# EasyEDA Pro project ProPrj_HTXStudio_OneHanded_Keyboard.epro, board 键盘-左手（大）
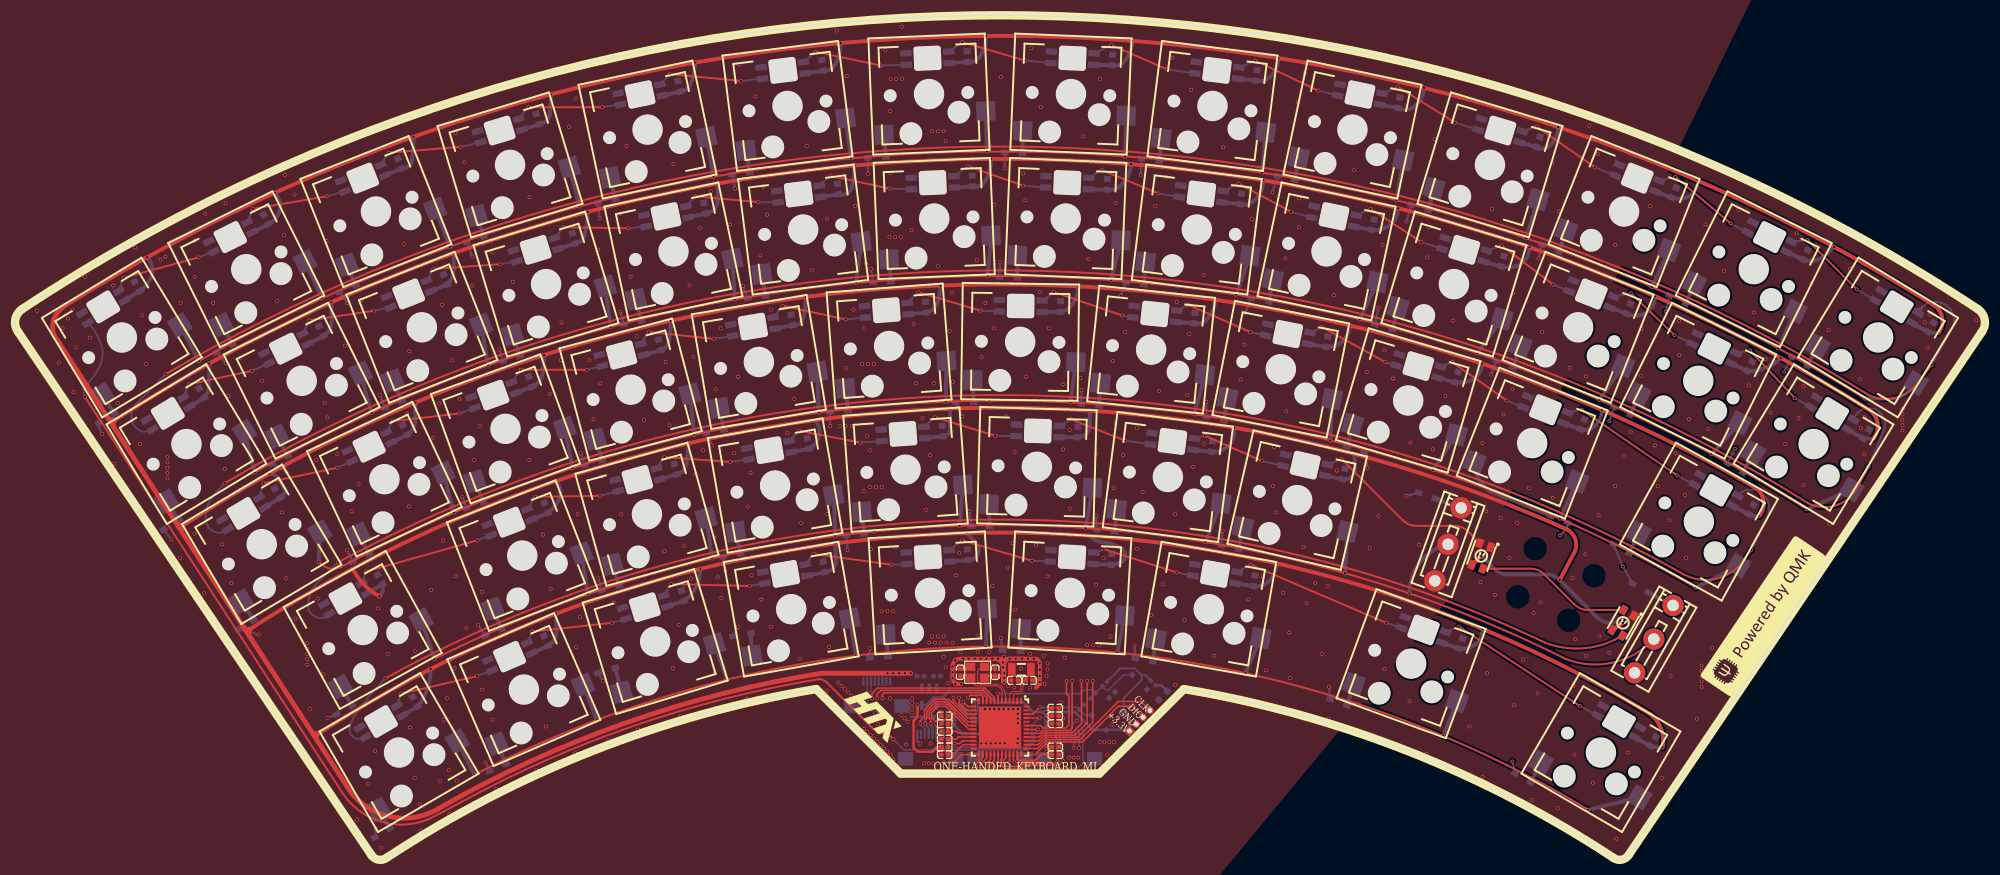
[diagram p16: board, top side]
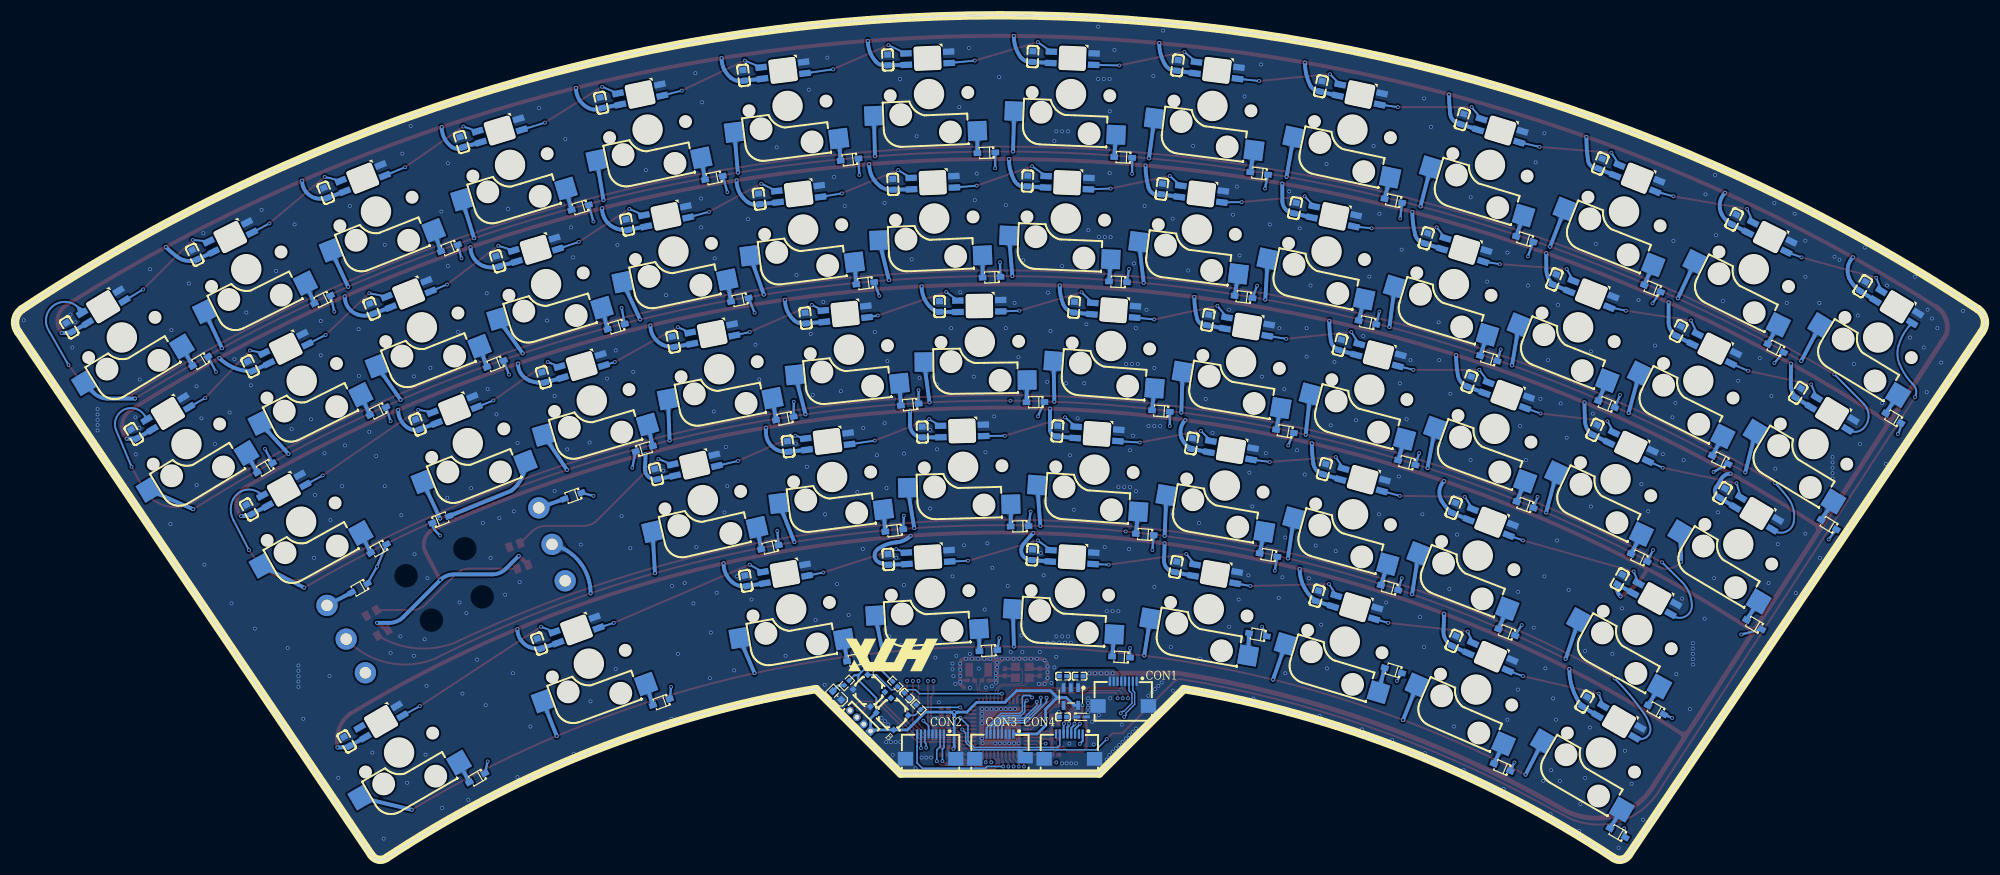
[diagram p17: board, bottom side, seen from below]

Outline 257.76 x 110.64 mm; copper layers: Top Layer, Inner1, Inner2, Bottom Layer. Coordinates in mm from the lower left corner of the outline.
Outline path: 0.4,69.11 arc(0,70.74) 0.9,72.15 arc(128.89,110.64) 256.87,72.14 arc(257.76,70.73) 257.36,69.11 211.15,0.6 arc(210.21,0) 209.13,0.27 arc(182.2,14.26) 152.95,22.36 141.89,11.29 115.89,11.29 104.82,22.36 arc(75.57,14.26) 48.63,0.27 arc(47.55,0) 46.61,0.6 0.4,69.11
Stack: Top Layer 0.035mm 外层铜厚1oz / Dielectric1 0.2104mm 7628 RC49% 8.6mil / Inner1 0.0152mm 内层铜厚 / Dielectric2 1.065mm 1.1mm H/HOZ Copper / Inner2 0.0152mm 内层铜厚 / Dielectric3 0.2104mm 7628 RC49% 8.6mil / Bottom Layer 0.035mm 外层铜厚1oz

## Design rules (mm)
template: 自定义配置
spacing copperThickness1oz (default): track to track 0.102, other pairs 0.152 to 0.3
spacing copperThickness2oz: track to track 0.203, other pairs 0.152 to 0.3
track width copperThickness1oz (default): min 0.127, default 0.254, max 2.54
track width copperThickness2oz: min 0.203, default 0.254, max 2.54
differential pair differentialPair (default): width min 0.127, default 0.254, max 2.54; gap min 0.152, default 0.152
via viaSize (default): diameter min 0.4, default 0.4, max 10; hole min 0.3, default 0.305, max 6.3

## Placement (name value [footprint] x y rotation side)
C1  100nF  [C0603]  15.97 75.13 301.2 bottom
C2  100nF  [C0603]  32.81 83.89 296.4 bottom
C3  100nF  [C0603]  50.32 91.21 291.6 bottom
C4  100nF  [C0603]  68.38 97.04 286.8 bottom
C5  100nF  [C0603]  86.87 101.34 282 bottom
C6  100nF  [C0603]  105.65 104.07 277.2 bottom
C7  100nF  [C0603]  124.6 105.22 272.4 bottom
C8  100nF  [C0603]  143.57 104.79 267.6 bottom
C9  100nF  [C0603]  162.44 102.77 262.8 bottom
C10  100nF  [C0603]  181.08 99.17 258 bottom
C11  100nF  [C0603]  199.35 94.03 253.2 bottom
C12  100nF  [C0603]  217.13 87.38 248.4 bottom
C13  100nF  [C0603]  234.29 79.26 243.6 bottom
C14  100nF  [C0603]  250.71 69.75 238.8 bottom
C15  100nF  [C0603]  24.42 61.17 301.2 bottom
C16  100nF  [C0603]  40.06 69.27 296.4 bottom
C17  100nF  [C0603]  56.33 76.04 291.6 bottom
C18  100nF  [C0603]  73.1 81.42 286.8 bottom
C19  100nF  [C0603]  90.26 85.37 282 bottom
C20  100nF  [C0603]  107.7 87.88 277.2 bottom
C21  100nF  [C0603]  125.28 88.92 272.4 bottom
C22  100nF  [C0603]  142.89 88.48 267.6 bottom
C23  100nF  [C0603]  160.4 86.58 262.8 bottom
C24  100nF  [C0603]  177.69 83.21 258 bottom
C25  100nF  [C0603]  194.63 78.41 253.2 bottom
C26  100nF  [C0603]  211.12 72.2 248.4 bottom
C27  100nF  [C0603]  227.03 64.64 243.6 bottom
C28  100nF  [C0603]  242.25 55.78 238.8 bottom
C29  100nF  [C0603]  34.33 48.04 300.7 bottom
C30  100nF  [C0603]  51.02 56.33 295.2 bottom
C31  100nF  [C0603]  67.45 62.65 290 bottom
C32  100nF  [C0603]  84.38 67.46 284.8 bottom
C33  100nF  [C0603]  101.67 70.72 279.6 bottom
C34  100nF  [C0603]  119.19 72.39 274.4 bottom
C35  100nF  [C0603]  136.8 72.47 269.2 bottom
C36  100nF  [C0603]  154.33 70.96 264 bottom
C37  100nF  [C0603]  171.66 67.86 258.8 bottom
C38  100nF  [C0603]  188.63 63.21 253.6 bottom
C39  100nF  [C0603]  205.11 57.03 248.4 bottom
C40  100nF  [C0603]  227.18 45.89 241.1 bottom
C41  100nF  [C0603]  47.77 36.73 298.8 bottom
C42  100nF  [C0603]  69.51 46.11 291.2 bottom
C43  100nF  [C0603]  86.43 51.18 285.5 bottom
C44  100nF  [C0603]  103.78 54.54 279.8 bottom
C45  100nF  [C0603]  121.38 56.16 274.1 bottom
C46  100nF  [C0603]  139.05 56.03 268.4 bottom
C47  100nF  [C0603]  156.61 54.15 262.7 bottom
C48  100nF  [C0603]  173.91 50.52 257 bottom
C49  100nF  [C0603]  52.37 20.72 300.1 bottom
C50  100nF  [C0603]  69.47 28.68 293.4 bottom
C51  100nF  [C0603]  87.38 34.58 286.8 bottom
C52  100nF  [C0603]  105.86 38.36 280.1 bottom
C53  100nF  [C0603]  124.65 39.96 273.4 bottom
C54  100nF  [C0603]  143.5 39.35 266.6 bottom
C55  100nF  [C0603]  162.15 36.54 259.9 bottom
C56  100nF  [C0603]  189.2 28.31 249.9 bottom
C57  100nF  [C0603]  214.39 15.49 239.8 bottom
C58  100nF  [C0402]  121.64 18.85 180 top
C59  100nF  [C0402]  121.64 16.81 180 top
C60  100nF  [C0402]  141.07 21.51 225 bottom
C61  100nF  [C0402]  121.64 13.77 0 top
C62  100nF  [C0402]  121.64 15.8 0 top
C63  100nF  [C0402]  136.12 17.83 180 top
C64  100nF  [C0402]  136.12 14.78 180 top
C65  100nF  [C0402]  136.12 19.86 180 top
C66  1uF  [C0402]  136.12 18.85 180 top
C67  1uF  [C0402]  136.12 13.77 180 top
C68  100nF  [C0402]  120.63 24.05 0 bottom
C69  1uF  [C0402]  118.47 24.05 180 bottom
C70  1uF  [C0402]  120.63 18.72 180 bottom
C71  20pF  [C0402]  123.67 24.56 90 top
C72  6pF  [C0402]  132.69 23.49 0 top
C73  20pF  [C0402]  128.25 24.56 90 top
C74  6pF  [C0402]  130.79 23.49 180 top
D1  1N4148WS  [SOD-323_L1.8-W1.3-LS2.5-RD]  11.96 57.86 31.2 bottom
D2  1N4148WS  [SOD-323_L1.8-W1.3-LS2.5-RD]  27.36 67.01 26.4 bottom
D3  1N4148WS  [SOD-323_L1.8-W1.3-LS2.5-RD]  43.48 74.85 21.6 bottom
D4  1N4148WS  [SOD-323_L1.8-W1.3-LS2.5-RD]  60.2 81.3 16.8 bottom
D5  1N4148WS  [SOD-323_L1.8-W1.3-LS2.5-RD]  77.4 86.34 12 bottom
D6  1N4148WS  [SOD-323_L1.8-W1.3-LS2.5-RD]  94.96 89.92 7.2 bottom
D7  1N4148WS  [SOD-323_L1.8-W1.3-LS2.5-RD]  112.76 92.02 2.4 bottom
D8  1N4148WS  [SOD-323_L1.8-W1.3-LS2.5-RD]  130.67 92.62 357.6 bottom
D9  1N4148WS  [SOD-323_L1.8-W1.3-LS2.5-RD]  148.57 91.72 352.8 bottom
D10  1N4148WS  [SOD-323_L1.8-W1.3-LS2.5-RD]  166.33 89.32 348 bottom
D11  1N4148WS  [SOD-323_L1.8-W1.3-LS2.5-RD]  183.83 85.45 343.2 bottom
D12  1N4148WS  [SOD-323_L1.8-W1.3-LS2.5-RD]  200.94 80.13 338.4 bottom
D13  1N4148WS  [SOD-323_L1.8-W1.3-LS2.5-RD]  217.55 73.39 333.6 bottom
D14  1N4148WS  [SOD-323_L1.8-W1.3-LS2.5-RD]  233.54 65.3 328.8 bottom
D15  1N4148WS  [SOD-323_L1.8-W1.3-LS2.5-RD]  20.41 43.9 31.2 bottom
D16  1N4148WS  [SOD-323_L1.8-W1.3-LS2.5-RD]  34.62 52.4 26.4 bottom
D17  1N4148WS  [SOD-323_L1.8-W1.3-LS2.5-RD]  49.49 59.67 21.6 bottom
D18  1N4148WS  [SOD-323_L1.8-W1.3-LS2.5-RD]  64.92 65.68 16.8 bottom
D19  1N4148WS  [SOD-323_L1.8-W1.3-LS2.5-RD]  80.79 70.38 12 bottom
D20  1N4148WS  [SOD-323_L1.8-W1.3-LS2.5-RD]  97.01 73.73 7.2 bottom
D21  1N4148WS  [SOD-323_L1.8-W1.3-LS2.5-RD]  113.44 75.71 2.4 bottom
D22  1N4148WS  [SOD-323_L1.8-W1.3-LS2.5-RD]  129.99 76.31 357.6 bottom
D23  1N4148WS  [SOD-323_L1.8-W1.3-LS2.5-RD]  146.53 75.53 352.8 bottom
D24  1N4148WS  [SOD-323_L1.8-W1.3-LS2.5-RD]  162.94 73.36 348 bottom
D25  1N4148WS  [SOD-323_L1.8-W1.3-LS2.5-RD]  179.11 69.83 343.2 bottom
D26  1N4148WS  [SOD-323_L1.8-W1.3-LS2.5-RD]  194.94 64.95 338.4 bottom
D27  1N4148WS  [SOD-323_L1.8-W1.3-LS2.5-RD]  210.29 58.77 333.6 bottom
D28  1N4148WS  [SOD-323_L1.8-W1.3-LS2.5-RD]  225.08 51.33 328.8 bottom
D29  1N4148WS  [SOD-323_L1.8-W1.3-LS2.5-RD]  30.17 30.8 30.7 bottom
D30  1N4148WS  [SOD-323_L1.8-W1.3-LS2.5-RD]  45.23 39.56 25.2 bottom
D31  1N4148WS  [SOD-323_L1.8-W1.3-LS2.5-RD]  60.16 46.48 20 bottom
D32  1N4148WS  [SOD-323_L1.8-W1.3-LS2.5-RD]  75.65 52.02 14.8 bottom
D33  1N4148WS  [SOD-323_L1.8-W1.3-LS2.5-RD]  91.59 56.13 9.6 bottom
D34  1N4148WS  [SOD-323_L1.8-W1.3-LS2.5-RD]  107.83 58.78 4.4 bottom
D35  1N4148WS  [SOD-323_L1.8-W1.3-LS2.5-RD]  124.24 59.95 359.2 bottom
D36  1N4148WS  [SOD-323_L1.8-W1.3-LS2.5-RD]  140.69 59.62 354 bottom
D37  1N4148WS  [SOD-323_L1.8-W1.3-LS2.5-RD]  157.05 57.81 348.8 bottom
D38  1N4148WS  [SOD-323_L1.8-W1.3-LS2.5-RD]  175.43 53.83 163.6 bottom
D39  1N4148WS  [SOD-323_L1.8-W1.3-LS2.5-RD]  202.09 44.57 158.4 bottom
D40  1N4148WS  [SOD-323_L1.8-W1.3-LS2.5-RD]  210.2 40.75 331.1 bottom
D41  1N4148WS  [SOD-323_L1.8-W1.3-LS2.5-RD]  43.05 19.63 28.8 bottom
D42  1N4148WS  [SOD-323_L1.8-W1.3-LS2.5-RD]  62.56 29.79 21.2 bottom
D43  1N4148WS  [SOD-323_L1.8-W1.3-LS2.5-RD]  77.9 35.63 15.5 bottom
D44  1N4148WS  [SOD-323_L1.8-W1.3-LS2.5-RD]  93.75 39.92 9.8 bottom
D45  1N4148WS  [SOD-323_L1.8-W1.3-LS2.5-RD]  109.94 42.61 4.1 bottom
D46  1N4148WS  [SOD-323_L1.8-W1.3-LS2.5-RD]  126.32 43.68 358.4 bottom
D47  1N4148WS  [SOD-323_L1.8-W1.3-LS2.5-RD]  142.72 43.12 352.7 bottom
D48  1N4148WS  [SOD-323_L1.8-W1.3-LS2.5-RD]  158.99 40.93 347 bottom
D49  1N4148WS  [SOD-323_L1.8-W1.3-LS2.5-RD]  184.76 47.67 340.2 bottom
D50  1N4148WS  [SOD-323_L1.8-W1.3-LS2.5-RD]  212.7 35.61 330.3 bottom
D51  1N4148WS  [SOD-323_L1.8-W1.3-LS2.5-RD]  48.05 3.52 30.1 bottom
D52  1N4148WS  [SOD-323_L1.8-W1.3-LS2.5-RD]  63.17 12.1 23.4 bottom
D53  1N4148WS  [SOD-323_L1.8-W1.3-LS2.5-RD]  77.4 24.82 16.8 bottom
D54  1N4148WS  [SOD-323_L1.8-W1.3-LS2.5-RD]  95.12 29.49 10.1 bottom
D55  1N4148WS  [SOD-323_L1.8-W1.3-LS2.5-RD]  113.04 26.55 3.4 bottom
D56  1N4148WS  [SOD-323_L1.8-W1.3-LS2.5-RD]  130.41 27.39 356.6 bottom
D57  1N4148WS  [SOD-323_L1.8-W1.3-LS2.5-RD]  147.75 26.2 349.9 bottom
D58  1N4148WS  [SOD-323_L1.8-W1.3-LS2.5-RD]  173.21 20.64 339.9 bottom
D59  1N4148WS  [SOD-323_L1.8-W1.3-LS2.5-RD]  197.31 10.73 329.9 bottom
D60  ESD5Z3V3  [SOD-523_L1.2-W0.8-LS1.6-RD]  118.21 18.72 180 bottom
FPC1  FPC-05FB-8PH20  [FPC-SMD_8P-P0.50_XUNPU_FPC-05FB-8PH20#2]  112.75 21.77 180 bottom
FPC2  FPC-05FB-8PH20  [FPC-SMD_8P-P0.50_XUNPU_FPC-05FB-8PH20#2]  137.97 14.85 180 bottom
FPC3  FPC-05FB-8PH20  [FPC-SMD_8P-P0.50_XUNPU_FPC-05FB-8PH20]  128.89 14.85 180 bottom
FPC4  FPC-05FB-8PH20  [FPC-SMD_8P-P0.50_XUNPU_FPC-05FB-8PH20#2]  119.8 14.85 180 bottom
H1  PZ127V-11-04-0720  [HDR-TH_4P-P1.27-V-M]  147.17 18.21 45 bottom
LDO1  ME6211C33M5G-N  [SOT-23-5_L3.0-W1.7-P0.95-LS2.8-BL]  119.61 21.39 0 bottom
LED1  NCD0603G1  [LED0603-RD_1]  150.22 21.51 45 bottom
R1  0Ω  [R0402]  121.64 17.83 0 top
R2  10kΩ  [R0402]  142.6 23.04 45 bottom
R3  0Ω  [R0402]  121.64 14.78 0 top
R4  10kΩ  [R0402]  139.55 19.99 225 bottom
R5  1kΩ  [R0402]  148.95 23.16 315 bottom
SW1  K9-1267T  [SW-TH_K9-1267T]  187.52 41.32 70.2 top
SW2  K9-1267T  [SW-TH_K9-1267T]  214.46 28.91 60.3 top
SW3  TS3735A 250gf 030  [SW-SMD_4P-L3.7-W3.7-P2.70-LS3.7]  146.03 22.15 45 bottom
SW4  TS3735A 250gf 030  [SW-SMD_4P-L3.7-W3.7-P2.70-LS3.7]  142.98 19.1 45 bottom
U1  Yo-WS2812B-3528反贴雾状  [LED-SMD_L3.2-W2.8_YO-WS2812B-3528]  11.51 72.44 31.2 bottom
U2  Yo-WS2812B-3528反贴雾状  [LED-SMD_L3.2-W2.8_YO-WS2812B-3528]  28.14 81.58 26.4 bottom
U3  Yo-WS2812B-3528反贴雾状  [LED-SMD_L3.2-W2.8_YO-WS2812B-3528]  45.48 89.29 21.6 bottom
U4  Yo-WS2812B-3528反贴雾状  [LED-SMD_L3.2-W2.8_YO-WS2812B-3528]  63.4 95.54 16.8 bottom
U5  Yo-WS2812B-3528反贴雾状  [LED-SMD_L3.2-W2.8_YO-WS2812B-3528#2]  81.78 100.25 12 bottom
U6  Yo-WS2812B-3528反贴雾状  [LED-SMD_L3.2-W2.8_YO-WS2812B-3528]  100.48 103.42 7.2 bottom
U7  Yo-WS2812B-3528反贴雾状  [LED-SMD_L3.2-W2.8_YO-WS2812B-3528]  119.39 105.01 2.4 bottom
U8  Yo-WS2812B-3528反贴雾状  [LED-SMD_L3.2-W2.8_YO-WS2812B-3528]  138.37 105.01 357.6 bottom
U9  Yo-WS2812B-3528反贴雾状  [LED-SMD_L3.2-W2.8_YO-WS2812B-3528]  157.28 103.42 352.8 bottom
U10  Yo-WS2812B-3528反贴雾状  [LED-SMD_L3.2-W2.8_YO-WS2812B-3528#3]  175.99 100.25 348 bottom
U11  Yo-WS2812B-3528反贴雾状  [LED-SMD_L3.2-W2.8_YO-WS2812B-3528]  194.37 95.54 343.2 bottom
U12  Yo-WS2812B-3528反贴雾状  [LED-SMD_L3.2-W2.8_YO-WS2812B-3528]  212.29 89.29 338.4 bottom
U13  Yo-WS2812B-3528反贴雾状  [LED-SMD_L3.2-W2.8_YO-WS2812B-3528]  229.62 81.58 333.6 bottom
U14  Yo-WS2812B-3528反贴雾状  [LED-SMD_L3.2-W2.8_YO-WS2812B-3528]  246.25 72.45 328.8 bottom
U15  CPG151101S11-16  [SMD_KEYBOARD-SW]  16.44 65.47 211.2 bottom
U16  CPG151101S11-16  [SMD_KEYBOARD-SW]  32.47 74.23 206.4 bottom
U17  CPG151101S11-16  [SMD_KEYBOARD-SW]  49.18 81.61 201.6 bottom
U18  CPG151101S11-16  [SMD_KEYBOARD-SW]  66.44 87.57 196.8 bottom
U19  CPG151101S11-16  [SMD_KEYBOARD-SW]  84.14 92.06 192 bottom
U20  CPG151101S11-16  [SMD_KEYBOARD-SW]  102.16 95.05 187.2 bottom
U21  CPG151101S11-16  [SMD_KEYBOARD-SW]  120.36 96.53 182.4 bottom
U22  CPG151101S11-16  [SMD_KEYBOARD-SW]  138.62 96.48 177.6 bottom
U23  CPG151101S11-16  [SMD_KEYBOARD-SW]  156.82 94.9 172.8 bottom
U24  CPG151101S11-16  [SMD_KEYBOARD-SW]  174.82 91.8 168 bottom
U25  CPG151101S11-16  [SMD_KEYBOARD-SW]  192.49 87.21 163.2 bottom
U26  CPG151101S11-16  [SMD_KEYBOARD-SW]  209.72 81.16 158.4 bottom
U27  CPG151101S11-16  [SMD_KEYBOARD-SW]  226.38 73.68 153.6 bottom
U28  CPG151101S11-16  [SMD_KEYBOARD-SW]  242.37 64.85 148.8 bottom
U29  Yo-WS2812B-3528反贴雾状  [LED-SMD_L3.2-W2.8_YO-WS2812B-3528]  19.97 58.48 31.2 bottom
U30  Yo-WS2812B-3528反贴雾状  [LED-SMD_L3.2-W2.8_YO-WS2812B-3528]  35.4 66.96 26.4 bottom
U31  Yo-WS2812B-3528反贴雾状  [LED-SMD_L3.2-W2.8_YO-WS2812B-3528]  51.48 74.12 21.6 bottom
U32  Yo-WS2812B-3528反贴雾状  [LED-SMD_L3.2-W2.8_YO-WS2812B-3528]  68.11 79.91 16.8 bottom
U33  Yo-WS2812B-3528反贴雾状  [LED-SMD_L3.2-W2.8_YO-WS2812B-3528#2]  85.17 84.29 12 bottom
U34  Yo-WS2812B-3528反贴雾状  [LED-SMD_L3.2-W2.8_YO-WS2812B-3528]  102.53 87.23 7.2 bottom
U35  Yo-WS2812B-3528反贴雾状  [LED-SMD_L3.2-W2.8_YO-WS2812B-3528]  120.08 88.7 2.4 bottom
U36  Yo-WS2812B-3528反贴雾状  [LED-SMD_L3.2-W2.8_YO-WS2812B-3528]  137.69 88.7 357.6 bottom
U37  Yo-WS2812B-3528反贴雾状  [LED-SMD_L3.2-W2.8_YO-WS2812B-3528]  155.23 87.23 352.8 bottom
U38  Yo-WS2812B-3528反贴雾状  [LED-SMD_L3.2-W2.8_YO-WS2812B-3528#3]  172.59 84.29 348 bottom
U39  Yo-WS2812B-3528反贴雾状  [LED-SMD_L3.2-W2.8_YO-WS2812B-3528]  189.65 79.91 343.2 bottom
U40  Yo-WS2812B-3528反贴雾状  [LED-SMD_L3.2-W2.8_YO-WS2812B-3528]  206.28 74.12 338.4 bottom
U41  Yo-WS2812B-3528反贴雾状  [LED-SMD_L3.2-W2.8_YO-WS2812B-3528]  222.37 66.96 333.6 bottom
U42  Yo-WS2812B-3528反贴雾状  [LED-SMD_L3.2-W2.8_YO-WS2812B-3528]  237.8 58.48 328.8 bottom
U43  CPG151101S11-16  [SMD_KEYBOARD-SW]  24.9 51.51 211.2 bottom
U44  CPG151101S11-16  [SMD_KEYBOARD-SW]  39.73 59.61 206.4 bottom
U45  CPG151101S11-16  [SMD_KEYBOARD-SW]  55.18 66.43 201.6 bottom
U46  CPG151101S11-16  [SMD_KEYBOARD-SW]  71.16 71.94 196.8 bottom
U47  CPG151101S11-16  [SMD_KEYBOARD-SW]  87.53 76.1 192 bottom
U48  CPG151101S11-16  [SMD_KEYBOARD-SW]  104.2 78.86 187.2 bottom
U49  CPG151101S11-16  [SMD_KEYBOARD-SW]  121.04 80.23 182.4 bottom
U50  CPG151101S11-16  [SMD_KEYBOARD-SW]  137.94 80.17 177.6 bottom
U51  CPG151101S11-16  [SMD_KEYBOARD-SW]  154.77 78.71 172.8 bottom
U52  CPG151101S11-16  [SMD_KEYBOARD-SW]  171.42 75.84 168 bottom
U53  CPG151101S11-16  [SMD_KEYBOARD-SW]  187.77 71.59 163.2 bottom
U54  CPG151101S11-16  [SMD_KEYBOARD-SW]  203.71 65.99 158.4 bottom
U55  CPG151101S11-16  [SMD_KEYBOARD-SW]  219.13 59.07 153.6 bottom
U56  CPG151101S11-16  [SMD_KEYBOARD-SW]  233.91 50.88 148.8 bottom
U57  Yo-WS2812B-3528反贴雾状  [LED-SMD_L3.2-W2.8_YO-WS2812B-3528]  29.85 45.38 30.7 bottom
U58  Yo-WS2812B-3528反贴雾状  [LED-SMD_L3.2-W2.8_YO-WS2812B-3528]  46.31 54.11 25.2 bottom
U59  Yo-WS2812B-3528反贴雾状  [LED-SMD_L3.2-W2.8_YO-WS2812B-3528]  62.55 60.87 20 bottom
U60  Yo-WS2812B-3528反贴雾状  [LED-SMD_L3.2-W2.8_YO-WS2812B-3528]  79.34 66.13 14.8 bottom
U61  Yo-WS2812B-3528反贴雾状  [LED-SMD_L3.2-W2.8_YO-WS2812B-3528]  96.54 69.85 9.6 bottom
U62  Yo-WS2812B-3528反贴雾状  [LED-SMD_L3.2-W2.8_YO-WS2812B-3528]  114 71.99 4.4 bottom
U63  Yo-WS2812B-3528反贴雾状  [LED-SMD_L3.2-W2.8_YO-WS2812B-3528]  131.59 72.55 359.2 bottom
U64  Yo-WS2812B-3528反贴雾状  [LED-SMD_L3.2-W2.8_YO-WS2812B-3528]  149.15 71.5 354 bottom
U65  Yo-WS2812B-3528反贴雾状  [LED-SMD_L3.2-W2.8_YO-WS2812B-3528]  166.55 68.87 348.8 bottom
U66  Yo-WS2812B-3528反贴雾状  [LED-SMD_L3.2-W2.8_YO-WS2812B-3528]  183.64 64.68 343.6 bottom
U67  Yo-WS2812B-3528反贴雾状  [LED-SMD_L3.2-W2.8_YO-WS2812B-3528]  200.27 58.95 338.4 bottom
U68  Yo-WS2812B-3528反贴雾状  [LED-SMD_L3.2-W2.8_YO-WS2812B-3528]  222.62 48.41 331.1 bottom
U69  CPG151101S11-16  [SMD_KEYBOARD-SW]  34.72 38.37 210.7 bottom
U70  CPG151101S11-16  [SMD_KEYBOARD-SW]  50.49 46.67 205.2 bottom
U71  CPG151101S11-16  [SMD_KEYBOARD-SW]  66.04 53.08 200 bottom
U72  CPG151101S11-16  [SMD_KEYBOARD-SW]  82.11 58.06 194.8 bottom
U73  CPG151101S11-16  [SMD_KEYBOARD-SW]  98.56 61.56 189.6 bottom
U74  CPG151101S11-16  [SMD_KEYBOARD-SW]  115.26 63.56 184.4 bottom
U75  CPG151101S11-16  [SMD_KEYBOARD-SW]  132.08 64.03 179.2 bottom
U76  CPG151101S11-16  [SMD_KEYBOARD-SW]  148.87 62.98 174 bottom
U77  CPG151101S11-16  [SMD_KEYBOARD-SW]  165.49 60.41 168.8 bottom
U78  CPG151101S11-16  [SMD_KEYBOARD-SW]  181.82 56.34 163.6 bottom
U79  CPG151101S11-16  [SMD_KEYBOARD-SW]  197.71 50.81 158.4 bottom
U80  CPG151101S11-16  [SMD_KEYBOARD-SW]  219.04 40.66 151.1 bottom
U81  Yo-WS2812B-3528反贴雾状  [LED-SMD_L3.2-W2.8_YO-WS2812B-3528]  43.21 34.22 28.8 bottom
U82  Yo-WS2812B-3528反贴雾状  [LED-SMD_L3.2-W2.8_YO-WS2812B-3528]  64.65 44.23 21.2 bottom
U83  Yo-WS2812B-3528反贴雾状  [LED-SMD_L3.2-W2.8_YO-WS2812B-3528]  81.42 49.79 15.5 bottom
U84  Yo-WS2812B-3528反贴雾状  [LED-SMD_L3.2-W2.8_YO-WS2812B-3528]  98.65 53.66 9.8 bottom
U85  Yo-WS2812B-3528反贴雾状  [LED-SMD_L3.2-W2.8_YO-WS2812B-3528]  116.18 55.79 4.1 bottom
U86  Yo-WS2812B-3528反贴雾状  [LED-SMD_L3.2-W2.8_YO-WS2812B-3528]  133.84 56.18 358.4 bottom
U87  Yo-WS2812B-3528反贴雾状  [LED-SMD_L3.2-W2.8_YO-WS2812B-3528]  151.45 54.81 352.7 bottom
U88  Yo-WS2812B-3528反贴雾状  [LED-SMD_L3.2-W2.8_YO-WS2812B-3528]  168.83 51.69 347 bottom
U89  XL-3528RGBC-WS2812B  [LED-SMD_4P-L3.5-W2.8-BR-1]  191.87 39.8 70.2 top
U90  XL-3528RGBC-WS2812B  [LED-SMD_4P-L3.5-W2.8-BR-1]  210.42 31.04 60.3 top
U91  CPG151101S11-16  [SMD_KEYBOARD-SW]  47.85 27.06 208.8 bottom
U92  CPG151101S11-16  [SMD_KEYBOARD-SW]  68.3 36.51 201.2 bottom
U93  CPG151101S11-16  [SMD_KEYBOARD-SW]  84.28 41.75 195.5 bottom
U94  CPG151101S11-16  [SMD_KEYBOARD-SW]  100.7 45.37 189.8 bottom
U95  CPG151101S11-16  [SMD_KEYBOARD-SW]  117.4 47.35 184.1 bottom
U96  CPG151101S11-16  [SMD_KEYBOARD-SW]  134.21 47.65 178.4 bottom
U97  CPG151101S11-16  [SMD_KEYBOARD-SW]  150.97 46.29 172.7 bottom
U98  CPG151101S11-16  [SMD_KEYBOARD-SW]  167.52 43.27 167 bottom
U99  Yo-WS2812B-3528反贴雾状  [LED-SMD_L3.2-W2.8_YO-WS2812B-3528]  47.87 18.11 30.1 bottom
U100  Yo-WS2812B-3528反贴雾状  [LED-SMD_L3.2-W2.8_YO-WS2812B-3528]  64.7 26.61 23.4 bottom
U101  Yo-WS2812B-3528反贴雾状  [LED-SMD_L3.2-W2.8_YO-WS2812B-3528]  82.4 33.08 16.8 bottom
U102  Yo-WS2812B-3528反贴雾状  [LED-SMD_L3.2-W2.8_YO-WS2812B-3528]  100.73 37.45 10.1 bottom
U103  Yo-WS2812B-3528反贴雾状  [LED-SMD_L3.2-W2.8_YO-WS2812B-3528]  119.46 39.65 3.4 bottom
U104  Yo-WS2812B-3528反贴雾状  [LED-SMD_L3.2-W2.8_YO-WS2812B-3528]  138.31 39.65 356.6 bottom
U105  Yo-WS2812B-3528反贴雾状  [LED-SMD_L3.2-W2.8_YO-WS2812B-3528]  157.03 37.45 349.9 bottom
U106  Yo-WS2812B-3528反贴雾状  [LED-SMD_L3.2-W2.8_YO-WS2812B-3528]  184.31 30.1 339.9 bottom
U107  Yo-WS2812B-3528反贴雾状  [LED-SMD_L3.2-W2.8_YO-WS2812B-3528]  209.89 18.11 329.9 bottom
U108  CPG151101S11-16  [SMD_KEYBOARD-SW]  52.67 11.06 210.2 bottom
U109  CPG151101S11-16  [SMD_KEYBOARD-SW]  68.64 19.04 203.4 bottom
U110  CPG151101S11-16  [SMD_KEYBOARD-SW]  85.43 25.11 196.8 bottom
U111  CPG151101S11-16  [SMD_KEYBOARD-SW]  102.82 29.18 190.1 bottom
U112  CPG151101S11-16  [SMD_KEYBOARD-SW]  120.56 31.19 183.3 bottom
U113  CPG151101S11-16  [SMD_KEYBOARD-SW]  138.42 31.12 176.7 bottom
U114  CPG151101S11-16  [SMD_KEYBOARD-SW]  156.14 28.97 169.9 bottom
U115  CPG151101S11-16  [SMD_KEYBOARD-SW]  181.96 21.9 159.9 bottom
U116  CPG151101S11-16  [SMD_KEYBOARD-SW]  206.15 10.44 149.8 bottom
U217  STM32G431CBU6  [VQFN-48_L7.0-W7.0-P0.50-BL-EP5.5]  128.89 17.32 180 top
X1  12MHz  [OSC-SMD_4P-L2.5-W2.0-BL]  125.96 24.56 0 top
X2  32.768kHz  [FC-135R_L3.2-W1.5]  131.68 24.9 0 top

## Footprints (pads in the part's own frame, mm; a bottom-side part is the same pattern mirrored in y, then rotated)
C0402
  rect 0.63x0.54 smd: 1(-0.465,0) 2(0.465,0)
C0603
  rect 0.8x0.9 smd: 1(-0.7,0) 2(0.7,0)
FC-135R_L3.2-W1.5
  rect 1x1.8 smd: 1(-1.25,0) 2(1.25,0)
FPC-SMD_8P-P0.50_XUNPU_FPC-05FB-8PH20
  rect 0.3x1.2 smd: 1(1.75,1.625) 2(1.25,1.625) 3(0.75,1.625) 4(0.25,1.625) 5(-0.25,1.625) 6(-0.75,1.625) 7(-1.25,1.625) 8(-1.75,1.625)
  rect 2x1.8 smd: 9(-3.3,-1.625)
  custom 2.003x1.801 smd: 10(3.3,-1.47)
FPC-SMD_8P-P0.50_XUNPU_FPC-05FB-8PH20#2
  rect 0.3x1.2 smd: 1(1.75,1.625) 2(1.25,1.625) 3(0.75,1.625) 4(0.25,1.625) 5(-0.25,1.625) 6(-0.75,1.625) 7(-1.25,1.625) 8(-1.75,1.625)
  rect 2x1.8 smd: 9(-3.3,-1.625) 10(3.3,-1.625)
HDR-TH_4P-P1.27-V-M
  rect 1x1 hole 0.6: 1(-1.905,0)
  round 1 hole 0.6: 2(-0.635,0) 3(0.635,0) 4(1.905,0)
LED0603-RD_1
  rect 0.8x0.8 smd: 1(-0.799,-0.004) 2(0.799,0.004)
LED-SMD_4P-L3.5-W2.8-BR-1
  rect 1.2x0.9 smd: 1(1.5,-0.75) 2(1.5,0.75) 3(-1.5,0.75) 4(-1.5,-0.75)
LED-SMD_L3.2-W2.8_YO-WS2812B-3528
  rect 1.5x0.82 smd: 1(2.8,0.75) 2(2.8,-0.75) 3(-2.8,-0.75) 4(-2.8,0.75)
LED-SMD_L3.2-W2.8_YO-WS2812B-3528#2
  rect 1.5x0.82 smd: 1(2.8,0.75) 2(2.8,-0.75) 3(-2.8,-0.75) 4(-2.8,0.75)
LED-SMD_L3.2-W2.8_YO-WS2812B-3528#3
  rect 1.5x0.82 smd: 1(2.8,0.75) 2(2.8,-0.75) 3(-2.8,-0.75) 4(-2.8,0.75)
OSC-SMD_4P-L2.5-W2.0-BL
  rect 1.2x1.1 smd: 1(-0.899,-0.712) 2(0.899,-0.712) 3(0.899,0.712) 4(-0.899,0.712)
R0402
  rect 0.566x0.54 smd: 1(-0.433,0) 2(0.433,0)
SMD_KEYBOARD-SW
  rect 2.5x2.55 smd: 1(-6.725,1.27) 2(6.725,-1.27)
SOD-323_L1.8-W1.3-LS2.5-RD
  rect 1x0.75 smd: 1(-1.173,0) 2(1.173,0)
SOD-523_L1.2-W0.8-LS1.6-RD
  rect 0.93x0.36 smd: 1(-0.635,0) 2(0.635,0)
SOT-23-5_L3.0-W1.7-P0.95-LS2.8-BL
  rect 0.49x1.157 smd: 1(-0.95,-1.153) 2(0,-1.153) 3(0.95,-1.153)
  rect 0.49x1.175 smd: 4(0.95,1.153) 5(-0.95,1.153)
SW-SMD_4P-L3.7-W3.7-P2.70-LS3.7
  rect 0.65x0.65 smd: 1(-1.6,1.35) 2(1.6,1.35) 3(-1.6,-1.35) 4(1.6,-1.35)
SW-TH_K9-1267T
  round 2.8 hole 1.5: 1(-5.08,0) 2(0,0) 3(5.08,0)
VQFN-48_L7.0-W7.0-P0.50-BL-EP5.5
  oval 0.28x0.85 smd: 1(-2.75,-3.474) 2(-2.25,-3.474) 3(-1.75,-3.474) 4(-1.25,-3.474) 5(-0.75,-3.474) 6(-0.25,-3.474) 7(0.25,-3.474) 8(0.75,-3.474) 9(1.25,-3.474) 10(1.75,-3.474) 11(2.25,-3.474) 12(2.75,-3.474) 25(2.75,3.474) 26(2.25,3.474) 27(1.75,3.474) 28(1.25,3.474) 29(0.75,3.474) 30(0.25,3.474) 31(-0.25,3.474) 32(-0.75,3.474) 33(-1.25,3.474) 34(-1.75,3.474) 35(-2.25,3.474) 36(-2.75,3.474)
  oval 0.85x0.28 smd: 13(3.474,-2.75) 14(3.474,-2.25) 15(3.474,-1.75) 16(3.474,-1.25) 17(3.474,-0.75) 18(3.474,-0.25) 19(3.474,0.25) 20(3.474,0.75) 21(3.474,1.25) 22(3.474,1.75) 23(3.474,2.25) 24(3.474,2.75) 37(-3.474,2.75) 38(-3.474,2.25) 39(-3.474,1.75) 40(-3.474,1.25) 41(-3.474,0.75) 42(-3.474,0.25) 43(-3.474,-0.25) 44(-3.474,-0.75) 45(-3.474,-1.25) 46(-3.474,-1.75) 47(-3.474,-2.25) 48(-3.474,-2.75)
  rect 5.5x5.5 smd: 49(0,0)

## Nets
As in the schematic.

Pads without a net: FPC4 2 8; LDO1 4; SW1 1; SW2 1; SW3 3; SW4 4; U107 2; U217 2 24 44 47

## Via types
v1: diameter 0.5, hole 0.3, Top Layer to Bottom Layer, 900 vias

## Routing (per net, layer and track width the routed paths; a pad name or vN(x,y) marks a point on that pad's centre or on a via; arc(x,y) is an arc through that point)
+3.3V: length 86.2
  Top Layer w0.203: 125.34,15.07 124.09,15.07 122.79,13.77 C61.2 122.11,13.81 121.21,14.71 R3.1 ; R1.1 121.21,17.9 122.11,18.8 C58.1 122.87,18.08 v1(122.91,18.08)
  Top Layer w0.254: v1(134.98,14.53) 135.23,14.78 C64.2 C67.2 134.22,13.77 133.45,13 131.29,13 131.14,13.16 131.14,13.77
  Top Layer w0.305: R3.1 120.63,14.78 119.99,14.15 118.09,14.15 117.58,14.65 117.58,18.21 118.09,18.72 v1(118.09,20.24)
  Bottom Layer w0.254: 147.42,24.18 147.93,24.18 R5.1 ; 147.42,24.18 147.42,23.54 145.06,21.19 145.06,19.28 ; 147.42,24.18 146.53,25.07 144.63,25.07 142.9,23.34
  Bottom Layer w0.355: 134.36,19.34 v1(134.88,19.34) ; 134.36,19.34 133.21,19.34 131.93,20.62 128.25,20.62 126.72,22.15 122.28,22.15 121.39,21.26 ; 134.36,19.34 arc(134.73,19.19) 134.88,18.83 ; v1(134.88,19.34) 134.88,18.83 ; v1(134.88,19.34) 135.4,19.34 ; 121.39,21.26 122.91,19.73 v1(122.91,18.08) 122.91,17.58 124.02,16.47 FPC3.1 ; 121.39,21.26 120.21,21.26 119.19,20.23 LDO1.5 ; 145.06,19.28 145.82,18.52 H1.1 145.67,17.01 SW4.1 141,17.01 138.67,19.34 135.4,19.34 ; 134.88,18.83 v1(134.88,18.49) 134.88,14.63 v1(134.98,14.53) ; 134.88,18.83 arc(135.03,19.19) 135.4,19.34
+5V: length 1696.4
  Top Layer w0.508: 6.33,72.44 arc(128.64,107.94) 251.03,72.69 arc(252.2,71) v1(251.69,69.01) ; 12.51,57.25 arc(127.31,91.81) 242.61,58.95 arc(243.74,57.19) v1(243.18,55.17) ; 12.96,56.58 arc(12.9,57.22) 13.28,57.75 arc(12.66,57.69) 12.09,57.91 ; 21.45,43.47 arc(123.77,75.32) 227.6,48.82 arc(228.81,47.06) v1(228.2,45.01) ; 21.84,42.86 arc(21.83,43.41) 22.1,43.9 ; 22.1,43.89 arc(21.51,43.9) 21,44.17 ; 30.27,29.92 arc(114.9,58.68) 202.95,43.33 arc(204.2,41.92) 203.94,40.05 v1(202.14,36.64) ; 30.6,29.38 arc(30.62,29.9) 30.91,30.34 arc(30.35,30.23) 29.86,30.51 ; 39.17,16.19 arc(126.15,42.84) 213.97,19.1 arc(215.41,17.13) v1(215.58,14.7) ; 39.47,15.7 arc(39.48,16.2) 39.79,16.58 ; 39.79,16.59 arc(39.25,16.55) 38.77,16.78 ; v1(47.67,34.5) arc(45.64,36.04) 44.15,38.11 ; v1(210.42,31.04) U90.3 ; U89.3 v1(191.87,39.8)
  Top Layer w0.635: 6.33,72.44 arc(5.06,70.81) 5.05,68.76 43.28,9.83 arc(48.62,5.74) 55.28,6.64 arc(79.63,17.84) 105.6,24.45 ; v1(117.2,24.43) v1(116.44,24.43) v1(115.67,24.43) v1(114.91,24.43) v1(114.15,24.43) 105.64,24.43
  Bottom Layer w0.508: 211.93,16.05 214.04,14.89 arc(214.81,14.75) v1(215.58,14.7) ; U12.1 C12.2 arc(217.64,86.59) 218.41,86.66 arc(219.72,87.5) v1(220.22,88.96) ; 66.29,95.63 C4.2 arc(69.5,96.8) 69.95,97.71 arc(70.07,98.98) v1(70.11,100.25) ; 22.75,59.28 C15.2 arc(25.23,61.37) 25.37,62.28 arc(25.36,63.63) v1(25.35,64.99) ; U7.1 C7.2 arc(125.52,104.64) 126.21,105.2 arc(126.85,106.5) v1(127.07,107.93) ; U6.1 C6.2 arc(106.63,103.56) 107.29,104.19 arc(107.85,105.54) v1(108.04,106.99) ; v1(140.66,58.84) 140.66,56.97 arc(140.18,55.81) C46.2 U86.1 ; 248.25,70.34 250.34,69.14 arc(251.01,69.04) v1(251.69,69.01) ; v1(122.34,59.1) 122.34,56.38 arc(122.07,55.73) 121.42,55.47 U85.1 ; U9.1 162.35,102.07 arc(163.25,102.04) 164.06,102.41 arc(164.99,103.57) v1(165.33,105.02) ; 196.83,94.01 199.15,93.36 arc(199.9,93.14) 200.63,93.39 arc(201.6,94.53) v1(201.95,95.98) ; U68.1 C40.2 arc(227.5,45.07) v1(228.2,45.01) ; U84.1 C44.2 arc(104.64,54.46) 105.13,55.29 arc(105.22,56.51) v1(104.63,57.59) ; U63.1 C35.2 arc(137.31,71.9) 137.77,72.18 arc(138.78,73.5) v1(139.14,75.12) ; 224.54,65.04 C27.2 arc(229.07,64.42) v1(231.06,65.73) ; 171.39,50.33 C48.2 arc(174.93,50.2) 175.36,51.36 arc(175.29,52.26) v1(175.27,53.16) ; 14.29,73.24 C1.2 arc(17.16,75.29) 17.75,76.25 arc(17.91,77.67) v1(17.25,78.93) ; U61.1 C33.2 arc(102.61,70.22) 103.1,70.91 arc(103.36,72.31) v1(103.45,73.74) ; 103.62,37.2 C52.2 arc(107.04,38.18) 107.42,39.29 arc(107.36,40.37) v1(107.35,41.44) ; U87.1 C47.2 156.98,53.45 arc(158.77,54.19) 159.52,55.99 v1(159.52,56.61) ; U33.1 C19.2 arc(91.48,85.18) 91.92,86.28 v1(91.94,88.59) ; U104.1 C54.2 arc(144.05,38.74) 144.63,38.91 arc(145.29,39.72) 144.88,40.69 arc(143.74,41.3) 142.47,41.58 arc(141.44,41.84) v1(140.58,42.45) ; U34.1 C20.2 arc(108.81,87.26) 109.45,88.06 arc(109.73,89.5) v1(109.83,90.96) ; U105.1 162.03,35.85 arc(163.04,35.9) 163.93,36.37 arc(164.77,37.47) v1(165.07,38.83) ; U59.1 C31.2 arc(68.5,62.54) 68.94,63.42 arc(69.13,64.76) v1(69.19,66.11) ; U5.1 87.01,100.65 arc(87.73,100.85) 88.24,101.39 arc(88.78,102.88) v1(88.97,104.44) ; 67.53,44.54 C42.2 arc(70.5,46.19) 71.09,47.04 arc(71.36,48.38) v1(70.76,49.61) ; U30.1 C16.2 arc(41.11,69.39) 41.38,70.41 v1(41.37,73.03) ; U32.1 C18.2 arc(74.08,81.11) 74.52,81.84 arc(74.81,83.34) v1(74.91,84.87) ; U64.1 C36.2 arc(155.08,70.28) 155.8,70.66 arc(156.71,71.88) v1(157.03,73.36) ; U39.1 C25.2 arc(195.44,77.59) 196.44,77.77 arc(197.7,78.73) v1(198.18,80.24) ; U65.1 C37.2 arc(172.32,67.23) 173.08,67.49 arc(174.22,68.51) v1(174.64,69.99) ; 82.24,66.12 84.55,66.78 arc(85.23,67.25) 85.57,67.99 arc(85.74,69.3) v1(85.79,70.61) ; U38.1 C24.2 arc(178.37,82.52) 179.17,82.73 arc(180.48,83.76) v1(180.97,85.35) ; U42.1 241.89,55.18 arc(242.53,55.17) v1(243.18,55.17) ; 48.35,89.63 C3.2 arc(51.46,90.82) 51.92,91.62 arc(52.08,93.16) v1(52.13,94.71) ; U35.1 C21.2 arc(126.27,88.3) 126.97,88.95 arc(127.52,90.33) v1(127.71,91.81) ; U99.1 C49.2 arc(53.95,22.42) v1(54.37,24.99) ; U106.1 C56.2 arc(189.73,27.66) 190.47,27.86 arc(191.62,28.81) v1(192.05,30.23) ; 67.56,27.03 C50.2 arc(70.59,28.87) 70.84,30.02 arc(70.78,31.13) v1(70.77,32.24) ; U66.1 C38.2 arc(189.47,62.53) 190.47,62.79 arc(191.56,63.66) v1(191.97,65) ; U57.1 34.69,47.43 arc(35.27,48.01) 35.15,48.82 arc(34.82,49.31) 34.52,49.83 arc(33.99,50.38) v1(33.26,50.59) ; U62.1 C34.2 arc(120.08,72.07) 120.62,72.82 arc(120.96,74) v1(121.08,75.23) ; U36.1 C22.2 arc(143.72,87.83) 144.5,88.19 arc(145.61,89.47) v1(146.01,91.13) ; 122.29,39.07 C53.2 arc(125.95,39.91) 125.83,41.32 arc(125.2,42.08) v1(124.52,42.8) ; U31.1 C17.2 arc(57.17,76.31) 57.38,77.39 v1(57.39,79.47) ; v1(210.42,31.04) 208.8,31.04 arc(207.83,31.23) 207,31.78 v1(202.14,36.64) arc(201.32,37.19) 200.34,37.39 195.34,37.39 arc(194.36,37.58) 193.54,38.13 v1(191.87,39.8) ; 157.91,86.13 C23.2 arc(161.14,85.83) 161.9,86.15 arc(162.97,87.41) v1(163.36,89.01) ; U58.1 C30.2 arc(52.01,56.39) 52.3,57.33 arc(52.36,58.62) v1(52.39,59.91) ; 178.57,98.94 C10.2 arc(181.83,98.27) 182.73,98.47 arc(183.93,99.56) v1(184.38,101.12) ; U2.1 C2.2 arc(33.85,83.79) 34.39,84.5 arc(34.66,86.01) v1(33.98,87.38) ; U40.1 C26.2 arc(211.89,71.28) 212.95,71.42 arc(214.18,72.34) v1(214.65,73.8) ; U83.1 86.62,50.5 arc(87.44,51) 87.86,51.86 arc(88.01,53.2) v1(88.07,54.55) ; U8.1 C8.2 arc(144.41,104.11) 145.14,104.57 arc(145.91,105.83) v1(146.18,107.28) ; U81.1 C41.2 arc(48.1,35.25) v1(47.67,34.5) ; U67.1 C39.2 arc(205.62,56.3) 206.35,56.56 arc(207.3,57.58) v1(207.65,58.93) ; U101.1 87.58,33.91 arc(89.11,35.77) v1(89.66,38.11) ; 231.79,79.66 C13.2 arc(235.25,78.46) 236.45,78.92 arc(237.28,79.56) v1(238.06,80.28)
GND: length 37.4
  Top Layer w0.254: 129.26,24.31 arc(129.35,24.37) v1(129.43,24.45)
  Top Layer w0.305: v1(134.09,23.28) 133.88,23.49 C72.2 ; C74.2 129.43,23.49 ; X1.2 127.11,24.1 C73.1 129.26,24.1 ; 122.66,25.01 122.67,25.03 C71.2 124.81,25.03 arc(124.99,25.1) X1.4
  Top Layer w0.508: 132.08,26.33 v1(132.53,26.33) v1(133.33,26.33) 133.45,26.33 arc(133.9,26.14) v1(134.09,25.7) v1(134.09,24.89) v1(134.09,24.09) v1(134.09,23.28) 134.09,23.04 133.58,22.53 ; 132.08,26.33 v1(131.74,26.33) v1(130.95,26.33) v1(130.15,26.33) ; 132.08,26.33 arc(132.08,26.34) 132.07,26.34 v1(128.63,26.34) 128.12,26.34 ; v1(129.26,25.2) 129.26,23.39 arc(129.31,23.27) v1(129.43,23.22) v1(129.43,23.83) v1(129.43,24.45) 129.43,25.61 arc(129.44,25.7) 129.45,25.78 arc(129.71,26.18) v1(130.15,26.33) ; v1(129.26,25.2) 129.26,25.44 ; v1(129.26,25.2) arc(129.23,25.48) 129.12,25.75 arc(128.89,26.04) 128.58,26.24 arc(128.36,26.31) 128.12,26.34 ; 128.12,26.34 v1(127.87,26.34) v1(127.1,26.34) v1(126.34,26.34) v1(125.58,26.34) v1(124.82,26.34) v1(124.06,26.34) 123.67,26.34 arc(123.44,26.31) 123.22,26.23 arc(122.81,25.86) v1(122.66,25.32) v1(122.66,24.56) v1(122.66,23.8) arc(122.77,23.4) 123.08,23.12 arc(123.25,23.06) 123.42,23.04 v1(123.8,23.04) ; v1(129.26,25.83) 129.26,25.44 ; 129.26,25.44 arc(129.28,25.62) 129.34,25.8 arc(129.66,26.19) v1(130.15,26.33)
  vias: v1(2.84,71.92) v1(5.7,65.14) v1(6.2,69.65) v1(6.9,70.9) v1(7.47,72.06) v1(7.6,61.26) v1(7.98,67.11) v1(9.12,76.38) v1(9.78,68.42) v1(12.8,75.23) v1(12.95,51.86) v1(13.43,59.83) v1(15.69,80.21) v1(16.31,54.46) v1(16.61,71.3) v1(17.12,64.95) v1(19.01,78.61) v1(19.65,79) v1(19.92,52.75) v1(19.92,52.06) v1(19.92,51.36) v1(19.92,50.66) v1(19.92,49.96) v1(21.57,39.55) v1(21.65,72.94) v1(23.47,81.1) v1(23.47,76.38) v1(23.47,42.72) v1(24.73,34.94) v1(24.87,84.63) v1(25.91,72.94) v1(27.07,41.34) v1(27.41,51.23) v1(27.54,86.03) v1(27.92,60.76) v1(28.3,36.24) v1(29.44,65.71) v1(32.27,62.75) v1(34.27,73.2) v1(34.9,45.52) v1(35.16,81.84) v1(35.28,89.71) v1(35.41,36.88) v1(36.55,87.17) v1(36.67,31.58) v1(38.2,28.37) v1(38.2,27.67) v1(38.2,26.97) v1(38.2,26.27) v1(38.2,25.58) v1(38.58,19.73) v1(39.4,52.35) v1(39.6,34.21) v1(40.36,24.31) v1(40.49,59.87) v1(40.74,81.08) v1(40.87,57.96) v1(42.14,53.14) v1(43.16,67.36) v1(44.05,45.64) v1(44.71,5.24) v1(44.93,49.2) v1(45.32,73.33) v1(46.2,9.96) v1(47.09,14.27) v1(47.47,32.94) v1(47.91,1.56) v1(48.74,26.97) v1(50.9,80.69) v1(51.29,58.44) v1(51.54,66.6) v1(51.54,46.28) v1(51.67,17.32) v1(52.3,27.35) v1(52.3,10.72) v1(52.94,7.29) v1(53.09,3.77) v1(54.46,35.36) v1(54.71,55.29) v1(55.51,59.77) v1(55.6,10.34) v1(55.86,72.69) v1(55.98,41.83) v1(56.11,18.34) v1(56.49,21.13) v1(56.75,11.73) v1(56.82,5.97) v1(57.13,65.45) v1(57.51,25.07) v1(57.63,95.17) v1(57.63,37.13) v1(57.78,10.34) v1(58.14,60.37) v1(58.78,91.36) v1(59.03,30.4) v1(59.79,75.23) v1(60.05,52.37) v1(60.81,56.82) v1(61.06,35.1) v1(61.08,22.3) v1(62.46,79.55) v1(62.46,18.34) v1(62.96,9.27) v1(65.13,75.74) v1(67.29,86.79) v1(67.29,52.37) v1(68.18,11.73) v1(69.06,42.59) v1(69.45,17.45) v1(69.94,61.05) v1(70.08,35.48) v1(71.4,65.45) v1(71.48,70.41) v1(72.47,96.01) v1(73.28,13.95) v1(73.38,99.74) v1(73.38,27.86) v1(73.6,45.26) v1(73.89,31.8) v1(75.16,65.45) v1(75.67,57.71) v1(76.3,79.93) v1(76.56,62.41) v1(76.68,50.21) v1(77.57,15.67) v1(78.34,33.7) v1(79.22,84.63) v1(79.29,45.26) v1(79.99,93.52) v1(80.54,76.39) v1(81.33,68.61) v1(81.52,17.08) v1(82.27,57.58) v1(84.94,40.44) v1(85.11,65.22) v1(85.59,56.91) v1(86.08,25.07) v1(86.15,91.14) v1(86.84,30.78) v1(87.05,18.82) v1(87.57,41.16) v1(88.24,75.23) v1(88.44,36.87) v1(88.75,69.65) v1(88.75,65.92) v1(89,50.47) v1(89.65,82.73) v1(90.02,53.64) v1(91.04,87.55) v1(91.54,42.21) v1(91.54,24.43) v1(91.67,61.64) v1(91.93,37) v1(92.31,69.63) v1(92.4,34.31) v1(93.58,83.23) v1(94.08,53.26) v1(94.59,63.3) v1(94.72,104.19) v1(95.72,21.12) v1(95.86,46.28) v1(96.24,50.72) v1(96.37,37.26) v1(96.88,100) v1(97.51,79.17) v1(97.64,34.09) v1(97.89,88.19) v1(98.4,84.5) v1(98.91,72.06) v1(98.91,30.53) v1(101.07,55.93) v1(101.96,60.37) v1(102.72,26.34) v1(102.85,44.12) v1(103.61,93.52) v1(104.25,77.2) v1(106.28,84) v1(106.26,45.29) v1(106.25,22.15) v1(106.53,27.86) v1(107.55,108.63) v1(107.72,23.21) v1(107.93,56.82) v1(108.16,22.78) v1(108.59,22.34) v1(108.69,64.44) v1(108.69,56.82) v1(108.69,35.74) v1(108.82,102.67) v1(109.03,21.91) v1(109.45,56.82) v1(109.46,21.47) v1(109.7,72.06) v1(109.96,85.65) v1(110.85,64.95) v1(111.1,69.65) v1(111.08,48.28) v1(111.1,17.19) v1(111.36,78.12) v1(111.48,55.55) v1(111.61,64.95) v1(111.54,16.76) v1(111.86,53.64) v1(111.86,48.82) v1(111.99,40.69) v1(111.97,16.32) v1(112.37,64.95) v1(112.41,15.89) v1(112.63,48.82) v1(112.84,15.46) v1(112.95,17.71) v1(113.28,15.02) v1(113.39,48.82) v1(113.39,32.56) v1(113.71,14.59) v1(113.9,106.09) v1(114.15,32.56) v1(114.14,14.15) v1(114.4,81.58) v1(114.53,102.28) v1(114.51,98.06) v1(114.53,89.97) v1(114.47,21.15) v1(114.58,13.72) v1(114.91,32.56) v1(114.91,13.13) v1(115.17,81.58) v1(115.17,40.94) v1(115.29,102.28) v1(115.93,81.58) v1(115.95,18.95) v1(116.05,109.14) v1(116.05,102.28) v1(116.38,18.52) v1(116.62,15.11) v1(116.82,18.08) v1(117.32,82.47) v1(117.37,21.15) v1(117.37,20.54) v1(117.37,19.92) v1(117.37,19.31) v1(117.58,70.15) v1(117.86,62.41) v1(118.72,57.83) v1(118.93,12.62) v1(119.22,45.85) v1(119.61,28.44) v1(119.54,12.62) v1(119.73,53) v1(119.8,15.22) v1(119.99,95.43) v1(119.99,29.26) v1(120.16,12.62) v1(120.25,62.41) v1(120.37,28.44) v1(120.75,95.43) v1(120.75,77.77) v1(120.75,29.26) v1(120.77,12.62) v1(121.13,28.44) v1(121.16,19.35) v1(121.52,95.43) v1(121.52,29.26) v1(121.52,26.59) v1(121.77,94.16) v1(121.77,25.2) v1(121.9,28.44) v1(122.15,23.16) v1(122.28,69.26) v1(122.6,74.3) v1(122.7,62.62) v1(122.66,28.44) v1(123.04,26.11) v1(123.04,23.04) v1(123.17,37.26) v1(123.55,40.18) v1(123.67,27.23) v1(125.83,78.54) v1(125.96,27.23) v1(126.09,29.39) v1(126.47,65.84) v1(126.44,15.24) v1(126.91,19.74) v1(126.98,72.95) v1(127.06,15.24) v1(127.48,27.23) v1(127.53,19.74) v1(127.67,15.24) v1(127.87,35.86) v1(128.12,85.77) v1(128.12,69.65) v1(128.14,19.74) v1(128.29,15.24) v1(128.76,19.74) v1(128.9,15.24) v1(129.01,102.54) v1(129.39,26.59) v1(129.37,19.74) v1(129.52,15.24) v1(129.64,58.09) v1(129.89,38.25) v1(129.95,22.72) v1(129.99,19.74) v1(130.53,41.45) v1(130.6,19.74) v1(130.79,53.39) v1(130.75,22.56) v1(130.89,32.78) v1(131.22,19.74) v1(131.22,19.12) v1(131.22,18.51) v1(131.22,17.89) v1(131.17,15.26) v1(131.24,15.88) v1(131.66,25.05) v1(131.93,89.9) v1(132.18,86.41) v1(132.31,63.3) v1(132.82,26.97) v1(132.82,22.53) v1(132.95,106.35) v1(133.58,41.2) v1(134.09,74.34) v1(134.22,98.6) v1(134.6,26.72) v1(134.72,23.04) v1(134.98,24.05) v1(135.1,37.13) v1(135.1,25.7) v1(135.1,24.94) v1(135.28,69.65) v1(136.88,20.62) v1(137.14,62.28) v1(137.14,53.77) v1(137.14,18.52) v1(137.34,26.48) v1(137.92,13.38) v1(138.03,56.31) v1(138.03,46.02) v1(138.53,13.38) v1(139.15,13.38) v1(139.4,63.11) v1(139.8,94.79) v1(139.93,11.99) v1(140.31,28.12) v1(140.44,78.66) v1(141.07,28.12) v1(141.45,53.21) v1(141.45,35.99) v1(141.84,28.12) v1(141.93,15.42) v1(141.96,102.28) v1(142.47,39.55) v1(142.54,15.42) v1(142.91,13.75) v1(143.16,15.42) v1(143.36,29.26) v1(143.52,17.72) v1(143.61,65.33) v1(143.74,48.69) v1(143.77,15.42) v1(143.99,86.03) v1(143.99,57.2) v1(143.95,18.16) v1(144.39,18.59) v1(145.01,53.01) v1(145.26,69.14) v1(146.79,56.56) v1(146.83,40.72) v1(147.55,48.18) v1(148.69,32.05) v1(149.2,85.65) v1(149.71,61.39) v1(150.22,36.12) v1(150.6,89.46) v1(151.49,105.08) v1(151.78,45.25) v1(151.83,22.92) v1(152,73.07) v1(153.01,31.42) v1(153.39,60.88) v1(153.65,68.88) v1(153.9,100.89) v1(154.15,51.48) v1(155.52,76.61) v1(155.61,54.51) v1(156.95,26.72) v1(158.11,93.33) v1(160.38,62.91) v1(160.89,67.49) v1(161.39,34.09) v1(161.87,83.93) v1(163.3,37.13) v1(163.68,24.81) v1(164.57,48.94) v1(164.75,54.07) v1(164.95,45.52) v1(165.97,34.97) v1(166.22,78.79) v1(166.35,58.72) v1(166.73,29.77) v1(166.85,23.8) v1(167.87,99.24) v1(168,86.63) v1(168,82.85) v1(168.63,40.94) v1(168.76,103.05) v1(169.01,33.58) v1(170.16,36.24) v1(171.05,26.97) v1(171.81,35.86) v1(171.85,18.47) v1(172.59,73.97) v1(172.95,50.98) v1(175.24,90.35) v1(176.89,63.93) v1(177.27,40.82) v1(178.41,45.01) v1(178.96,80.56) v1(179.17,66.72) v1(179.18,25) v1(180.32,63.04) v1(182.48,20.75) v1(182.6,54.66) v1(183.75,41.3) v1(184.66,13.88) v1(184.76,78.92) v1(185.02,82.85) v1(185.52,53.77) v1(185.78,94.41) v1(187.17,60.76) v1(187.17,48.31) v1(188.18,70.65) v1(189.21,98.47) v1(190.35,17.45) v1(191.75,36.37) v1(192.01,54.58) v1(192.04,10.83) v1(192.51,45.64) v1(192.64,24.43) v1(193.27,85.27) v1(193.65,34.72) v1(194.41,44.75) v1(194.79,58.34) v1(195.56,39.55) v1(195.94,61.64) v1(196.06,74.22) v1(196.19,20.24) v1(196.57,44.12) v1(197.33,26.21) v1(198.1,48.69) v1(198.46,7.84) v1(198.73,32.31) v1(199.24,21.77) v1(199.62,33.7) v1(199.83,69.15) v1(201.14,91.24) v1(201.14,77.77) v1(201.21,47.41) v1(201.91,6.78) v1(202,84.93) v1(203.43,64.44) v1(203.81,36.88) v1(203.94,22.78) v1(204.07,13.77) v1(204.19,28.88) v1(205.51,40.03) v1(205.59,63.33) v1(205.59,26.72) v1(206.01,96.14) v1(206.48,10.08) v1(207.11,92.51) v1(207.24,45.13) v1(207.37,29.26) v1(208.64,27.1) v1(209.4,80.57) v1(209.4,48.94) v1(209.54,2.76) v1(210.54,52.88) v1(211.03,14.04) v1(211.43,56.06) v1(212.83,69.52) v1(212.79,63.39) v1(213.97,85.65) v1(214.61,54.28) v1(214.99,48.94) v1(215.5,10.72) v1(216.51,44.5) v1(216.64,24.05) v1(217.3,53.25) v1(217.78,70.59) v1(217.78,66.09) v1(218.54,47.8) v1(218.67,39.55) v1(219.05,57.71) v1(220.07,18.46) v1(220.7,25.45) v1(220.7,24.75) v1(220.7,24.05) v1(220.7,23.35) v1(220.7,22.66) v1(221.21,83.23) v1(221.59,56.44) v1(222.1,27.74) v1(223.62,77.14) v1(225.53,85.14) v1(226.42,30.28) v1(226.93,62.15) v1(227.53,71.69) v1(229.08,65.58) v1(229.47,33.58) v1(229.72,58.6) v1(231.64,54.46) v1(233.02,38.66) v1(233.15,82.09) v1(233.4,57.83) v1(234.04,62.03) v1(234.04,49.07) v1(235.05,75.49) v1(237.34,69.39) v1(237.47,43.99) v1(240.12,77.37) v1(241.47,62.92) v1(241.53,56.56) v1(242,53.1) v1(242.04,57.96) v1(247,59.04) v1(247,58.34) v1(247,57.64) v1(247,56.94) v1(247,56.24) v1(249.91,70.41) v1(250.29,67.11) v1(250.55,71.42) v1(256.66,70.69)
VDDA: length 4.4
  Top Layer w0.203: C62.2 123.17,15.8 123.44,16.07 125.34,16.07
  Top Layer w0.254: C62.2 122.11,14.81 R3.2
ADNS9800_CS: length 8.6
  Top Layer w0.203: 126.13,20.87 v1(125.37,20.87)
  Bottom Layer w0.203: FPC3.7 130.14,17.36 128.63,18.86 126.15,18.86 125.66,19.35 125.66,20.59 v1(125.37,20.87)
ADNS9800_MOTION: length 12.3
  Top Layer w0.203: v1(124.69,21.26) 125,21.57 126.41,21.57 126.64,21.35 126.64,20.87
  Bottom Layer w0.203: FPC3.8 130.64,17.29 128.76,19.17 126.27,19.17 125.96,19.48 125.96,21.31 125.76,21.51 124.94,21.51 v1(124.69,21.26)
BOOT0: length 9.3
  Top Layer w0.203: v1(134.09,19.96) 133.2,19.07 132.43,19.07
  Bottom Layer w0.203: v1(134.09,19.96) 138.97,19.96 R4.2 140,18.92 SW4.3
COL1: length 193.5
  Top Layer w0.203: v1(112.14,21.15) 112.14,21.79 112.84,22.49 126.88,22.49 128.14,21.23 128.14,20.87
  Inner2 w0.254: v1(139.22,14.64) 139.22,14.33 139.04,14.14 138.03,14.14 135.66,16.51 116.53,16.51 112.14,20.91 v1(112.14,21.15)
  Inner2 w0.305: v1(112.14,21.15) 112.14,22.06 arc(111.48,23.65) 109.89,24.31 109.58,24.31 arc(79.89,17.18) 52.32,4.06 arc(51.74,3.71) 51.16,3.35 arc(49.96,3.1) 48.74,3.22 arc(47.9,3.57) v1(47.18,4.12) v1(40.91,18.58) v1(31.85,29.51) v1(20.42,41.96) v1(11.37,55.78)
  Bottom Layer w0.203: FPC2.7 139.22,14.64 v1(139.22,14.64)
  Bottom Layer w0.305: D15.1 v1(20.42,41.96) ; v1(47.18,4.12) 47.03,2.93 ; D29.1 v1(31.85,29.51) ; 42.03,19.07 v1(40.91,18.58) ; D1.1 arc(11.06,56.49) v1(11.37,55.78)
COL2: length 193
  Top Layer w0.203: v1(112.82,21.15) 112.82,21.7 113.3,22.18 126.69,22.18 127.64,21.23 127.64,20.87
  Inner2 w0.254: 112.75,21.15 112.75,20.8 116.68,16.87 132.62,16.87 133.35,17.6 135.07,17.6 138,14.67 v1(138.54,14.67)
  Inner2 w0.305: v1(27.54,65.07) v1(35.5,50.79) 40.49,41.45 arc(40.9,39.12) 39.85,37.01 35.16,31.67 arc(34.4,29.95) 34.77,28.12 47.09,12.75 arc(47.76,11.43) 47.86,9.96 arc(47.91,7.59) 48.74,5.38 arc(50.19,4.23) 52.04,4.37 arc(78.01,16.93) 105.93,24.19 arc(108.22,24.54) 110.53,24.84 110.83,24.84 arc(112.19,24.28) 112.75,22.92 112.75,21.15
  Bottom Layer w0.203: v1(138.54,14.67) 138.54,15.18 138.72,15.36 FPC2.6
  Bottom Layer w0.305: D16.1 v1(35.5,50.79) ; 26.31,66.49 v1(27.54,65.07)
COL3: length 184.2
  Top Layer w0.203: v1(113.49,21.15) 113.48,21.17 113.48,21.61 113.75,21.88 126.53,21.88 127.14,21.28 127.14,20.87
  Inner2 w0.254: v1(113.49,21.15) 113.49,20.56 116.83,17.22 132.46,17.22 133.2,17.96 138.66,17.96 v1(138.91,18.21)
  Inner2 w0.305: v1(113.49,21.15) 113.49,23.73 113.37,23.85 arc(112.92,24.93) 111.84,25.38 111.54,25.38 arc(109.78,25.16) 108.03,24.92 arc(85.72,19.95) 64.44,11.61 arc(63.13,11.41) 61.83,11.61 arc(59.05,13.52) 57.89,16.69 arc(57.65,19.06) 57.13,21.39 52.43,37.77 arc(51.94,38.47) 51.16,38.78 44.43,39.42 arc(43.7,39.8) v1(43.41,40.56) 40.11,52.63 arc(40.33,53.89) 41.25,54.79 47.22,57.71 arc(47.59,58.01) 47.73,58.47 v1(47.73,60.88) v1(43.48,72.89)
  Bottom Layer w0.203: FPC2.5 138.22,17.51 v1(138.91,18.21)
  Bottom Layer w0.305: D3.1 v1(43.48,72.89) ; v1(43.41,40.56) D30.1 ; D17.1 v1(47.73,60.88)
COL4: length 159.5
  Top Layer w0.203: v1(118.43,17.83) 118.43,18.18 119,18.74 119,19.63 120.37,21 122.19,21 124.62,18.57 125.34,18.57
  Inner2 w0.305: v1(59.79,79.04) v1(63.35,66.85) arc(63.32,65.9) 63.22,64.95 arc(62.93,64.3) 62.33,63.93 57.76,62.15 arc(56.68,61.25) 56.36,59.87 v1(58.52,47.55) v1(60.6,30.74) 60.6,29.09 arc(60.41,28.12) 59.86,27.29 59.39,26.83 arc(58.84,26) 58.65,25.03 58.65,16.7 arc(58.84,15.73) 59.39,14.9 v1(61.55,12.75) arc(62.95,11.92) 64.56,12.11 arc(88.35,21.15) 113.34,25.99 116.31,25.99 arc(118.03,25.28) 118.74,23.56 118.74,19.75 118.43,19.45 v1(118.43,17.83)
  Bottom Layer w0.254: FPC4.3 119.05,17.11 118.43,17.74 v1(118.43,17.83)
  Bottom Layer w0.305: 62.1,11.63 v1(61.55,12.75) ; D18.1 v1(63.35,66.85) ; D4.1 v1(59.79,79.04) ; D42.1 v1(60.6,30.74) ; D31.1 v1(58.52,47.55)
COL5: length 138
  Top Layer w0.203: v1(119.13,17.83) 119.1,17.86 119.1,18.34 119.3,18.54 119.3,19.5 120.5,20.7 122.06,20.7 124.69,18.07 125.34,18.07
  Inner2 w0.305: v1(76.5,84.03) v1(79.22,71.8) 79.22,70.15 arc(78.94,69.34) 78.21,68.88 73.64,67.49 arc(72.74,66.86) 72.37,65.84 v1(74.02,53.26) v1(76.3,36.88) v1(76.94,23.42) arc(77.71,21) 79.73,19.48 arc(80.66,19.32) 81.58,19.48 arc(97.5,23.86) 113.82,26.45 116.76,26.45 arc(118.51,25.72) 119.23,23.98 119.23,17.93 arc(119.2,17.86) v1(119.13,17.83)
  Bottom Layer w0.254: FPC4.4 119.55,17.25 119.13,17.67 v1(119.13,17.83)
  Bottom Layer w0.305: D53.1 v1(76.94,23.42) ; D19.1 v1(79.22,71.8) ; 74.52,51.72 v1(74.02,53.26) ; D43.1 v1(76.3,36.88) ; 76.25,86.1 v1(76.5,84.03)
COL6: length 119.8
  Top Layer w0.203: 125.34,17.57 124.76,17.57 121.93,20.39 120.62,20.39 119.61,19.38 119.61,18.54 119.83,18.32 v1(119.83,17.83)
  Inner2 w0.305: v1(119.83,17.83) 119.83,24.44 arc(119.11,26.18) 117.38,26.9 114.26,26.9 arc(113.4,26.81) 112.54,26.72 111.74,26.72 arc(111.18,26.88) 110.72,27.23 arc(109.83,27.54) 109.07,26.97 arc(108.61,26.41) 107.94,26.14 arc(102.77,25.31) 97.64,24.31 97.51,24.31 arc(96.29,24.73) 95.61,25.83 v1(94.59,30.53) v1(92.92,37.88) v1(91.16,54.28) 89.64,70.15 arc(89.91,71.14) 90.78,71.68 94.46,72.31 arc(95.16,72.77) 95.35,73.58 arc(95.26,74.39) v1(95.23,75.21) v1(94.21,87.93)
  Bottom Layer w0.254: v1(119.83,17.83) 119.83,17.61 120.05,17.38 FPC4.5
  Bottom Layer w0.305: 95.84,73.58 v1(95.23,75.21) ; D33.1 v1(91.16,54.28) ; D54.1 v1(94.59,30.53) ; D6.1 v1(94.21,87.93) ; 92.59,39.72 v1(92.92,37.88)
COL7: length 101
  Top Layer w0.203: v1(120.52,17.83) 120.52,18.06 119.91,18.67 119.91,19.25 120.75,20.09 121.81,20.09 124.82,17.07 125.34,17.07
  Inner2 w0.305: v1(120.52,17.83) 120.52,24.8 120.53,24.81 arc(119.79,26.61) 117.99,27.35 112.24,27.35 arc(111.98,27.47) v1(111.86,27.74) v1(108.94,40.56) arc(107.23,48.61) v1(106.66,56.82) 106.66,69.61 arc(106.85,70.58) 107.4,71.41 111.25,75.25 arc(111.8,76.08) 111.99,77.05 v1(111.99,77.39) v1(111.59,89.86)
  Bottom Layer w0.254: FPC4.6 120.55,17.79 v1(120.52,17.83)
  Bottom Layer w0.305: D55.1 v1(111.86,27.74) ; 108.77,42.53 v1(108.94,40.56) ; D34.1 v1(106.66,56.82) ; 111.59,91.97 v1(111.59,89.86) ; D21.1 v1(111.99,77.39)
COL8: length 110.8
  Top Layer w0.203: 132.43,18.57 134.05,18.57 v1(134.09,18.61)
  Inner2 w0.305: v1(129.52,90.6) v1(128.88,78.28) arc(128.29,76.31) 126.72,74.98 arc(124.64,73.19) 123.93,70.53 v1(123.93,58.09) v1(124.87,45.62) v1(128.98,29.03) 130.27,27.74 135.36,27.74 136.32,26.77 136.32,23.11 133.33,20.12 133.33,19.35 134.07,18.61 v1(134.09,18.61)
  Bottom Layer w0.203: v1(134.09,18.61) 133.07,17.59 133.07,15.53 132.25,14.71 121.33,14.71 121.05,14.99 FPC4.7
  Bottom Layer w0.305: D8.1 v1(129.52,90.6) ; D46.1 v1(124.87,45.62) ; D22.1 v1(128.88,78.28) ; D56.1 v1(128.98,29.03) ; D35.1 v1(123.93,58.09)
COL9: length 95.9
  Top Layer w0.203: v1(137.58,23.42) 137.58,21.71 137.9,21.39 137.9,17.65 137.5,17.25 134.54,17.25 134.21,17.58 132.44,17.58 132.43,17.57
  Inner2 w0.305: v1(137.58,23.42) 137.58,24.69 arc(138.32,26.48) 140.12,27.23 141.84,27.23 arc(142.51,27.28) 143.11,27.61 arc(143.88,28.04) 144.76,28.12 arc(145.51,28.33) 145.9,29.01 147.04,37.51 arc(146.68,39.52) 145.01,40.69 arc(142.47,42.26) v1(141.47,45.09) v1(139.55,61.52) v1(144.67,73.89) v1(147.3,89.71)
  Bottom Layer w0.305: D23.1 v1(144.67,73.89) ; D47.1 v1(141.47,45.09) ; D36.1 v1(139.55,61.52) ; 147.41,91.86 v1(147.3,89.71)
COL10: length 102.3
  Top Layer w0.203: v1(138.32,23.42) 138.32,17.23 138.03,16.94 134.47,16.94 134.09,16.56 132.45,16.56 132.43,16.57
  Inner2 w0.305: v1(164.55,87.45) v1(160.99,71.66) v1(155.87,60) arc(156.18,57.88) 157.08,55.93 arc(158.18,53.56) 158.6,50.98 v1(158.02,43.07) arc(157.51,41.62) 156.19,40.82 149.96,39.93 arc(148.52,39.21) 147.8,37.77 v1(146.48,28.09) arc(146.06,26.99) 145.01,26.47 143.76,26.47 arc(143.06,26.53) 142.35,26.6 140.86,26.6 arc(139.06,25.86) 138.32,24.06 v1(138.32,23.42)
  Bottom Layer w0.305: D37.1 v1(155.87,60) ; 165.19,89.57 v1(164.55,87.45) ; D57.1 v1(146.48,28.09) ; D48.1 v1(158.02,43.07) ; D24.1 v1(160.99,71.66)
COL11: length 143.6
  Top Layer w0.203: v1(122.91,15.22) 123.6,15.22 123.96,15.57 125.34,15.57
  Inner2 w0.305: v1(122.91,15.22) 122.91,14.02 123.67,13.26 128.5,13.26 129.64,12.11 138.79,12.11 139.93,13.26 139.93,18.34 138.93,19.33 138.93,23.62 arc(139.68,25.42) 141.47,26.16 142.7,26.16 arc(153.79,24.7) 164.74,22.4 arc(166.62,22.17) 168.51,22.4 arc(169.88,23.07) 170.79,24.31 174.86,34.09 arc(175.89,34.88) 177.14,35.23 arc(178.46,35.74) 179.3,36.88 182.6,45.9 arc(182.58,46.85) v1(182.09,47.67) arc(179.41,49.31) v1(177.01,51.36) 174.73,56.18 arc(174.19,58.32) 174.47,60.5 v1(178.41,72.31) v1(182.09,83.62)
  Bottom Layer w0.305: 183.66,48.07 v1(182.09,47.67) ; 176.56,53.5 v1(177.01,51.36) ; D25.1 v1(178.41,72.31) ; D11.1 v1(182.09,83.62)
COL12: length 114.8
  Top Layer w0.203: v1(139.55,23.42) 139.55,17.83 138.36,16.64 134.6,16.64 134.03,16.07 132.43,16.07
  Inner2 w0.305: v1(199.37,78.79) v1(193.14,63.55) 180.95,36.75 arc(179.77,35.25) 178.03,34.47 arc(176.27,33.72) 174.98,32.31 171.3,23.29 arc(170.59,22.27) 169.52,21.64 arc(168.05,21.37) 166.56,21.51 arc(154.97,24.08) 143.2,25.7 141.83,25.7 arc(140.22,25.03) v1(139.55,23.42)
  Bottom Layer w0.305: 199.85,80.56 v1(199.37,78.79) ; D26.1 v1(193.14,63.55)
COL13: length 133
  Top Layer w0.203: v1(140.29,23.42) 140.29,17.94 138.69,16.33 134.73,16.33 133.96,15.57 132.43,15.57
  Inner2 w0.305: v1(216,71.8) v1(208.64,57.45) v1(202.16,42.47) 198.1,32.82 arc(196.5,31.05) 194.16,30.66 179.3,33.7 arc(177.37,33.53) 175.87,32.31 v1(171.93,22.66) arc(170.98,21.86) 169.9,21.26 arc(168.66,20.9) 167.37,20.88 arc(155.59,23.55) 143.64,25.25 142,25.25 arc(140.75,24.7) v1(140.29,23.42)
  Bottom Layer w0.305: D13.1 v1(216,71.8) ; D58.1 v1(171.93,22.66) ; D27.1 v1(208.64,57.45) ; v1(202.16,42.47) 202.72,43.03 arc(203.06,43.54) D39.1
COL14: length 150.6
  Top Layer w0.203: 132.43,15.07 133.89,15.07 134.85,16.03 139.02,16.03 141.03,18.04 v1(141.03,23.42)
  Inner2 w0.305: v1(231.5,63.93) v1(225.08,53.84) arc(222.19,52.05) 218.8,51.74 arc(215.61,51.13) 213.46,48.69 v1(210.42,38.4) v1(195.94,12.88) arc(193.57,11.61) 190.89,11.86 arc(168.04,20.27) 144.11,24.79 142.16,24.79 arc(141.28,24.36) v1(141.03,23.42)
  Bottom Layer w0.305: 209.18,41.32 v1(210.42,38.4) 211.68,36.19 ; D59.1 v1(195.94,12.88) ; D28.1 v1(225.08,53.84) ; D14.1 v1(231.5,63.93)
ENCODER_A: length 13.9
  Top Layer w0.203: v1(137.16,12.91) 136.62,12.37 132.23,12.37 131.8,11.94 129.53,11.94 129.01,12.46 129.01,13.13 129.13,13.26 129.13,13.77
  Bottom Layer w0.203: v1(137.16,12.91) 137.16,14.37 136.72,14.82 FPC2.2
ENCODER_B: length 12.5
  Top Layer w0.203: v1(136.42,12.91) 136.18,12.67 132.11,12.67 131.68,12.24 129.66,12.24 129.31,12.58 129.31,13 129.63,13.33 129.63,13.77
  Bottom Layer w0.203: FPC2.1 136.22,14.68 136.42,14.48 v1(136.42,12.91)
